# EAGLE design sensor-dev-board (EAGLE 9.1.1)
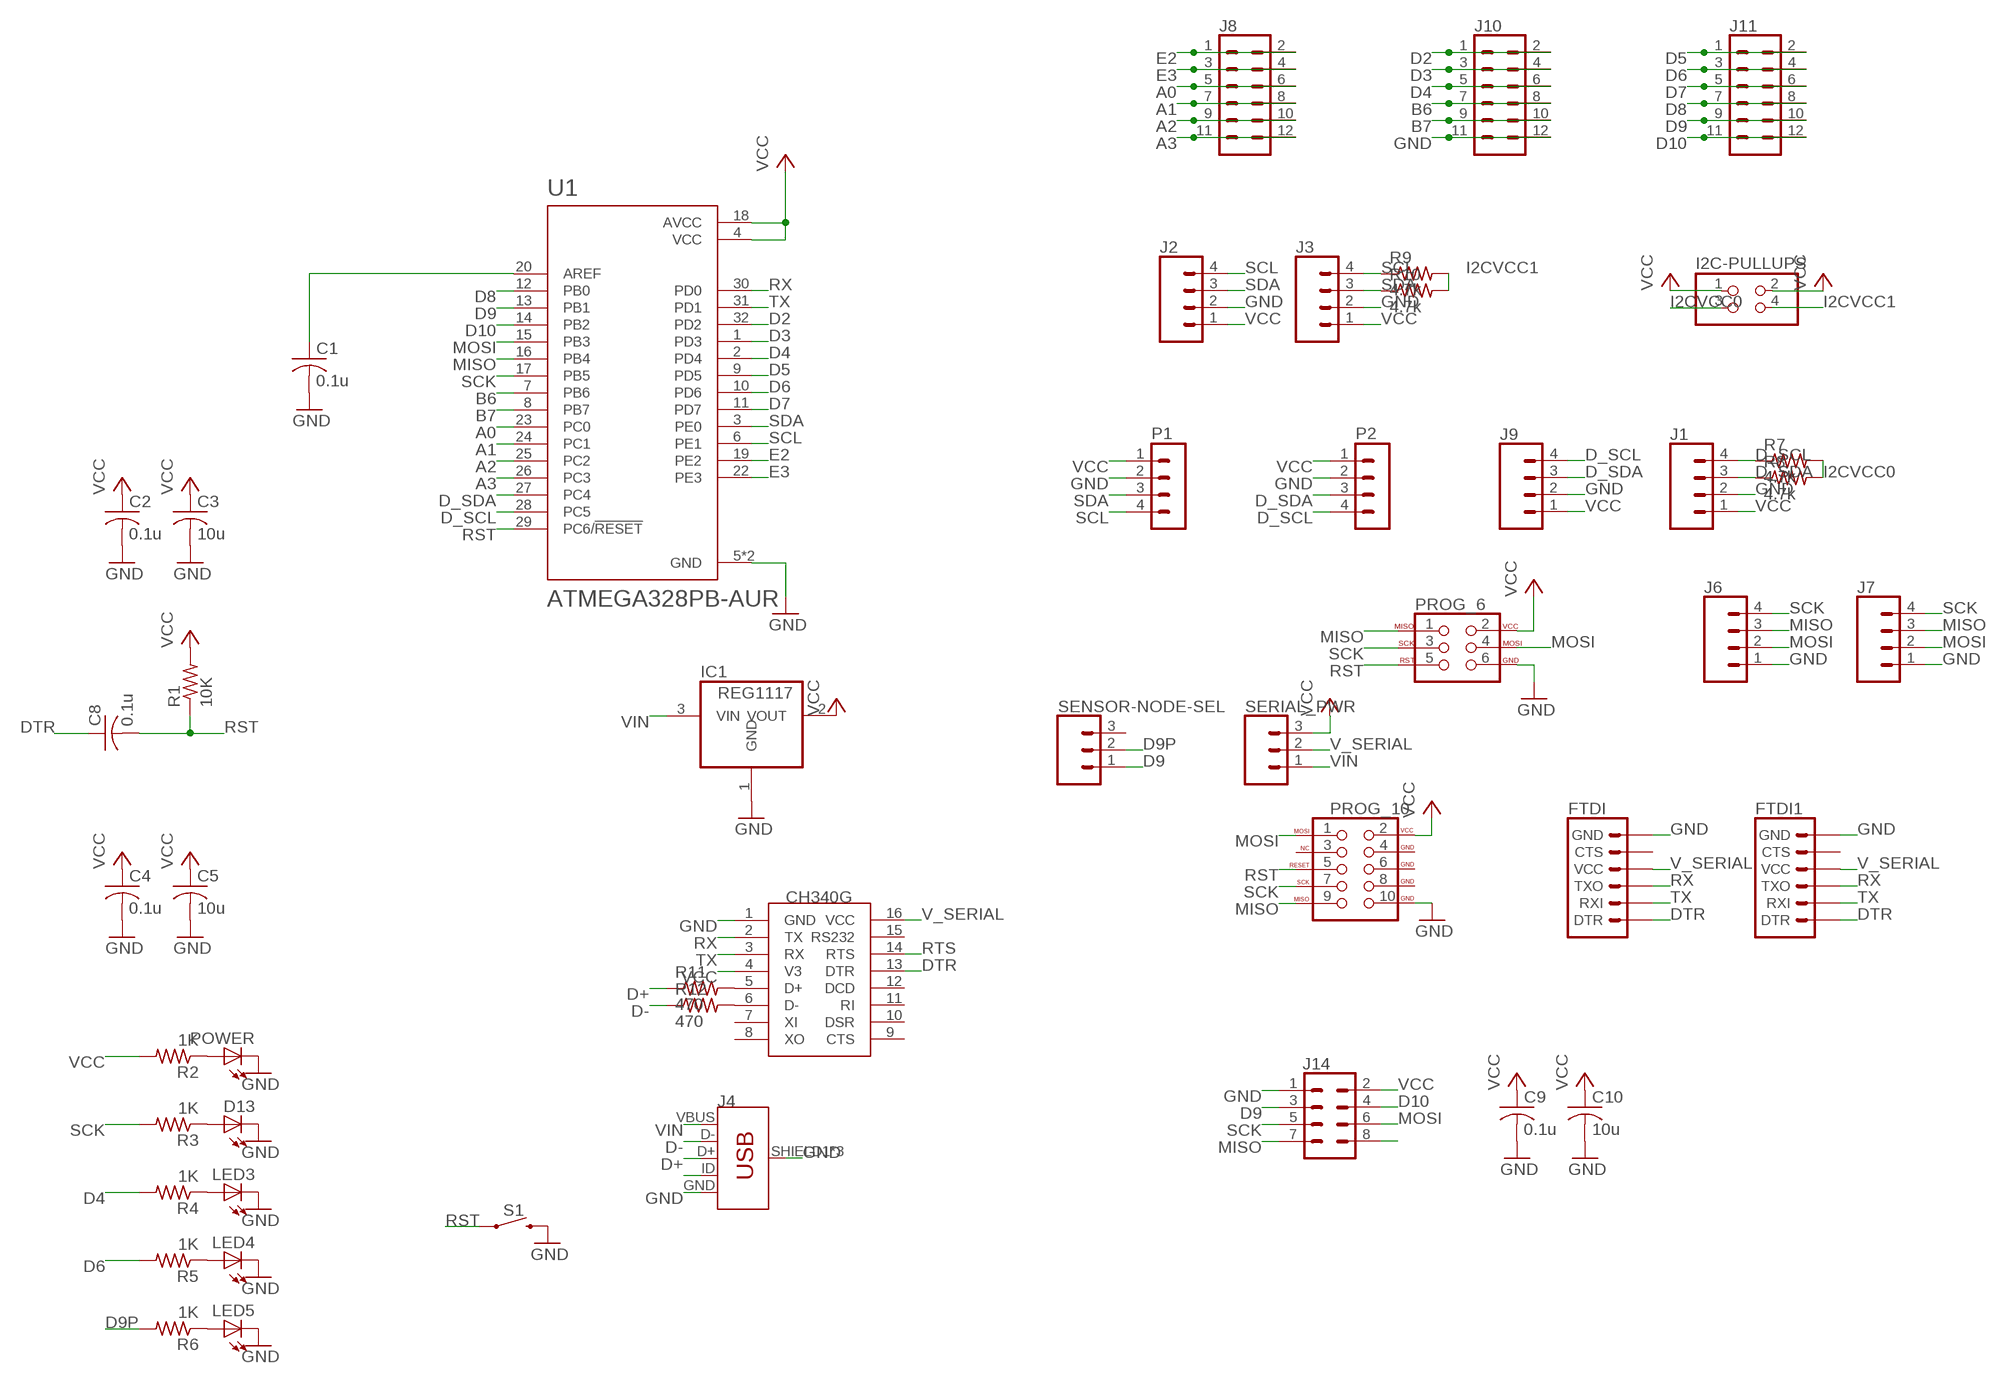
[diagram p0: schematic, sheet 1]

## Parts
C1  0.1u  C-USC1206  [C1206]
C2  0.1u  C-USC1206  [C1206]
C3  10u  C-USC1206  [C1206]
C4  0.1u  C-USC1206  [C1206]
C5  10u  C-USC1206  [C1206]
C8  0.1u  C-USC1206  [C1206]
C9  0.1u  C-USC1206  [C1206]
C10  10u  C-USC1206  [C1206]
CH340C  CH340C  CH340G  [SOIC16]
D13  LEDSML1206  [SML1206]
FTDI  6_PIN_SERIAL_TARGET  [1X06]
FTDI1  6_PIN_SERIAL_TARGET  [1X06]
I2C-PULLUPS  PINHD-2X2  [2X02]
IC1  REG1117  [SOT223]
J1  CONN_04  [1X04]
J2  CONN_04  [1X04]
J3  CONN_04  [1X04]
J4  USB_MICRO-B_FEMALE-SMT  [USB-B-MICRO-SMD]
J6  CONN_04  [1X04]
J7  CONN_04  [1X04]
J8  CONN_06X2PTH_FEMALE  [2X6]
J9  CONN_04  [1X04]
J10  CONN_06X2PTH_FEMALE  [2X6]
J11  CONN_06X2PTH_FEMALE  [2X6]
J14  CONN_04X2  [2X4]
LED3  LEDSML1206  [SML1206]
LED4  LEDSML1206  [SML1206]
LED5  LEDSML1206  [SML1206]
P1  B4B-PH-K  [B4B-PH-K]
P2  B4B-PH-K  [B4B-PH-K]
POWER  LEDSML1206  [SML1206]
PROG_6  AVR_SPI_PROG_3X2PTH  [2X3]
PROG_10  AVR_SPI_PROG_5X2PTH  [2X5]
R1  10K  R-US_R1206  [R1206]
R2  1K  R-US_R1206  [R1206]
R3  1K  R-US_R1206  [R1206]
R4  1K  R-US_R1206  [R1206]
R5  1K  R-US_R1206  [R1206]
R6  1K  R-US_R1206  [R1206]
R7  4.7k  R-US_R1206  [R1206]
R8  4.7k  R-US_R1206  [R1206]
R9  4.7k  R-US_R1206  [R1206]
R10  4.7k  R-US_R1206  [R1206]
R11  470  R-US_R1206  [R1206]
R12  470  R-US_R1206  [R1206]
S1  MOMENTARY-SWITCH-SPST-PTH-6.0MM  [TACTILE_SWITCH_PTH_6.0MM]
SENSOR-NODE-SEL  CONN_03  [1X03]
SERIAL_PWR  CONN_03  [1X03]
U1  ATMEGA328PB-AUR  [QFP80P900X900X120-32N]

## Nets
A0: J8.5 J8.6 U1.23(PC0)
A1: J8.7 J8.8 U1.24(PC1)
A2: J8.9 J8.10 U1.25(PC2)
A3: J8.11 J8.12 U1.26(PC3)
B6: J10.7 J10.8 U1.7(PB6)
B7: J10.9 J10.10 U1.8(PB7)
D2: J10.1 J10.2 U1.32(PD2)
D3: J10.3 J10.4 U1.1(PD3)
D4: J10.5 J10.6 R4.2 U1.2(PD4)
D5: J11.1 J11.2 U1.9(PD5)
D6: J11.3 J11.4 R5.2 U1.10(PD6)
D7: J11.5 J11.6 U1.11(PD7)
D8: J11.7 J11.8 U1.12(PB0)
D9: J11.9 J11.10 J14.3 SENSOR-NODE-SEL.1 U1.13(PB1)
D9P: R6.2 SENSOR-NODE-SEL.2
D10: J11.11 J11.12 J14.4 U1.14(PB2)
D+: J4.D+ R11.1
D-: J4.D- R12.1
D_SCL: J1.4 J9.4 P2.4 R7.1 U1.28(PC5)
D_SDA: J1.3 J9.3 P2.3 R8.1 U1.27(PC4)
DTR: C8.1 CH340C.13(DTR) FTDI1.1(DTR) FTDI.1(DTR)
E2: J8.1 J8.2 U1.19(PE2)
E3: J8.3 J8.4 U1.22(PE3)
GND: C1.2 C2.2 C3.2 C4.2 C5.2 C9.2 C10.2 CH340C.1(GND) D13.C FTDI1.6(GND) FTDI.6(GND) IC1.1(GND) J1.2 J2.2 J3.2 J4.GND J4.SHIELD1(SHIELD) J4.SHIELD2(SHIELD) J4.SHIELD3(SHIELD) J6.1 J7.1 J9.2 J10.11 J10.12 J14.1 LED3.C LED4.C LED5.C P1.2 P2.2 POWER.C PROG_6.6 PROG_10.10(GND) S1.3 U1.5(GND) U1.21(GND)
I2CVCC0: I2C-PULLUPS.3 R7.2 R8.2
I2CVCC1: I2C-PULLUPS.4 R9.2 R10.2
MISO: J6.3 J7.3 J14.7 PROG_6.1 PROG_10.9(MISO) U1.16(PB4)
MOSI: J6.2 J7.2 J14.6 PROG_6.4 PROG_10.1(MOSI) U1.15(PB3)
N$1: CH340C.5(D+) R11.2
N$2: CH340C.6(D-) R12.2
N$5: C1.1 U1.20(AREF)
N$9: J4.ID
N$10: POWER.A R2.1
N$11: D13.A R3.1
N$12: LED3.A R4.1
N$13: LED4.A R5.1
N$14: LED5.A R6.1
N$27: J14.8
RST: C8.2 PROG_6.5 PROG_10.5(RESET) R1.1 S1.1 U1.29(PC6/!RESET)
RTS: CH340C.14(RTS)
RX: CH340C.2(TX) FTDI1.3(TXO) FTDI.3(TXO) U1.30(PD0)
SCK: J6.4 J7.4 J14.5 PROG_6.3 PROG_10.7(SCK) R3.2 U1.17(PB5)
SCL: J2.4 J3.4 P1.4 R9.1 U1.6(PE1)
SDA: J2.3 J3.3 P1.3 R10.1 U1.3(PE0)
TX: CH340C.3(RX) FTDI1.2(RXI) FTDI.2(RXI) U1.31(PD1)
V_SERIAL: CH340C.16(VCC) FTDI1.4(VCC) FTDI.4(VCC) SERIAL_PWR.2
VCC: C2.1 C3.1 C4.1 C5.1 C9.1 C10.1 CH340C.4(V3) I2C-PULLUPS.1 I2C-PULLUPS.2 IC1.2(VOUT) J1.1 J2.1 J3.1 J9.1 J14.2 P1.1 P2.1 PROG_6.2 PROG_10.2(VCC) R1.2 R2.2 SERIAL_PWR.3 U1.4(VCC) U1.18(AVCC)
VIN: IC1.3(VIN) J4.VBUS SERIAL_PWR.1
Unconnected: CH340C.7(XI) CH340C.8(XO) CH340C.9(CTS) CH340C.10(DSR) CH340C.11(RI) CH340C.12(DCD) CH340C.15(RS232) FTDI1.5(CTS) FTDI.5(CTS) PROG_10.3(NC) SENSOR-NODE-SEL.3

## Power pins joined to a net without a drawn wire
GND: PROG_10.4(GND) PROG_10.6(GND) PROG_10.8(GND)

## Library data of the parts
C1-C5 C8-C10 = rcl:C-US: CAPACITOR, American symbol; SPICEPREFIX: C
CH340C = ch340g:CH340G
D13 LED3-LED5 POWER = led:LED: LED OSRAM: - CHIPLED LG R971, LG N971, LY N971, LG Q971, LY Q971, LO R971, LY R971 LH N974, LH R974 LS Q976, LO Q976, LY Q976 LO Q996 - Hyper CHIPLED LW Q18S LB Q993, LB Q99A, LB R99A - SideLED LS A670, LO A670, LY A670, LG A670, LP A670 LB A673, LV A673, LT A673, LW A673 LH A674 LY A675 LS A676, LA A676, LO A676, LY A676, LW A676 LS A679, LY A679, LG A679 - Hyper Micro SIDELED® LS Y876, LA Y876, LO Y876, LY Y876 LT Y87S - SmartLED LW L88C, LW L88S LB L89C, LB L89S, LG L890 LS L89K, LO L89K, LY L89K LS L896, LA L896, LO L896, LY L896 - TOPLED LS T670, LO T670, LY T670, LG T670, LP T670 LSG T670, LSP T670, LSY T670, LOP T670, LYG T670 LG T671, LOG T671, LSG T671 LB T673, LV T673, LT T673, LW T673 LH T674 LS T676, LA T676, LO T676, LY T676, LB T676, LH T676, LSB T676, LW T676 LB T67C, LV T67C, LT T67C, LS T67K, LO T67K, LY T67K, LW E67C LS E67B, LA E67B, LO E67B, LY E67B, LB E67C, LV E67C, LT E67C LW T67C LS T679, LY T679, LG T679 LS T770, LO T770, LY T770, LG T770, LP T770 LB T773, LV T773, LT T773, LW T773 LH T774 LS E675, LA E675, LY E675, LS T675 LS T776, LA T776, LO T776, LY T776, LB T776 LHGB T686 LT T68C, LB T68C - Hyper Mini TOPLED® LB M676 - Mini TOPLED Santana® LG M470 LS M47K, LO M47K, LY M47K Source: http://www.osram.convergy.de LUXEON: - LUMILED® LXK2-PW12-R00, LXK2-PW12-S00, LXK2-PW14-U00, LXK2-PW14-V00 LXK2-PM12-R00, LXK2-PM12-S00, LXK2-PM14-U00 LXK2-PE12-Q00, LXK2-PE12-R00, LXK2-PE12-S00, LXK2-PE14-T00, LXK2-PE14-U00 LXK2-PB12-K00, LXK2-PB12-L00, LXK2-PB12-M00, LXK2-PB14-N00, LXK2-PB14-P00, LXK2-PB14-Q00 LXK2-PR12-L00, LXK2-PR12-M00, LXK2-PR14-Q00, LXK2-PR14-R00 LXK2-PD12-Q00, LXK2-PD12-R00, LXK2-PD12-S00 LXK2-PH12-R00, LXK2-PH12-S00 LXK2-PL12-P00, LXK2-PL12-Q00, LXK2-PL12-R00 Source: www.luxeon.com KINGBRIGHT: KA-3528ASYC Source: www.kingbright.com
FTDI FTDI1 = SparkFun-Connectors:6_PIN_SERIAL_TARGET: 6-pin header connection for use with the "FTDI BASIC" pinout - TARGET SIDE. Also known as "Arduino Serial Program Header". It is used to mate with our FTDI Basic serial programmers using the Arduino IDE. Note, this device has "TARGET" in the name. It is intended to be used on a design that contains a target micro-controller that you wish to program. The "sister" device, named "CABLE" is inteneded to be used on a design that usually lives on the end of your USB cable and prvides the converter chip (FTDI232 or FTDI231x) to commnicate serial RX/TX. You can populate with some of these: Break Away Headers - Straight <https://www.sparkfun.com/products/116> (PRT-00116) For reference (or to suit your programming needs) check out these designs: SparkFun FTDI Basic Breakout - 5V <https://www.sparkfun.com/products/9716> (DEV-09716) SparkFun FTDI Basic Breakout - 3.3V <https://www.sparkfun.com/products/9873> (DEV-09873) SparkFun FTDI SmartBasic <https://www.sparkfun.com/products/12935> (DEV-12935) SparkFun Beefy 3 - FTDI Basic Breakout <https://www.sparkfun.com/products/13746> (DEV-13746)
I2C-PULLUPS = pinhead:PINHD-2X2: PIN HEADER
IC1 = burr-brown:REG1117: 800mA and 1A Low Dropout (LDO) Positive Regulator 1.8V, 2.5V, 2.85V, 3.3V, 5V, and Adj; MPN: REG1117; OC_FARNELL: 1097566; OC_NEWARK: 14P6981
J1-J3 J6 J7 J9 = SparkFun-Connectors:CONN_04: Multi connection point. Often used as Generic Header-pin footprint for 0.1 inch spaced/style header connections On any of the 0.1 inch spaced packages, you can populate with these: Break Away Headers - Straight <https://www.sparkfun.com/products/116> (PRT-00116) Break Away Male Headers - Right Angle <https://www.sparkfun.com/products/553> (PRT-00553) Female Headers <https://www.sparkfun.com/products/115> (PRT-00115) Break Away Headers - Machine Pin <https://www.sparkfun.com/products/117> (PRT-00117) Break Away Female Headers - Swiss Machine Pin <https://www.sparkfun.com/products/743> (PRT-00743) For SCREWTERMINALS and SPRING TERMINALS visit here: Screw Terimnals on SparkFun.com <https://www.sparkfun.com/search/results?term=Screw+Terminals> (5mm/3.5mm/2.54mm spacing) This device is also useful as a general connection point to wire up your design to another part of your project. Our various solder wires solder well into these plated through hole pads. Hook-Up Wire - Assortment (Stranded, 22 AWG) <https://www.sparkfun.com/products/11375> (PRT-11375) Hook-Up Wire - Assortment (Solid Core, 22 AWG) <https://www.sparkfun.com/products/11367> (PRT-11367) View the entire wire category on our website here <https://www.sparkfun.com/categories/141> Special notes: Molex polarized connector foot print use with SKU : PRT-08231 with associated crimp pins and housings. 1MM SMD Version SKU: PRT-10208; PROD_ID: CONN-09696
J4 = SparkFun-Connectors:USB_MICRO-B: USB Type Micro-B Connector Male/female and PTH/SMT variants SparkFun Products: SparkFun microB USB Breakout <https://www.sparkfun.com/products/12035> SparkFun USB microB Plug Breakout <https://www.sparkfun.com/products/10031> SparkFun ESP8266 Thing <https://www.sparkfun.com/products/13231>; PROD_ID: CONN-11752
J8 J10 J11 = SparkFun-Connectors:CONN_06X2: Multi connection point. Often used as Generic Header-pin footprint for 0.1 inch spaced/style header connections On any of the 0.1 inch spaced packages, you can populate with these: Break Away Headers - Straight <https://www.sparkfun.com/products/116> (PRT-00116) Break Away Male Headers - Right Angle <https://www.sparkfun.com/products/553> (PRT-00553) Female Headers <https://www.sparkfun.com/products/115> (PRT-00115) Break Away Headers - Machine Pin <https://www.sparkfun.com/products/117> (PRT-00117) Break Away Female Headers - Swiss Machine Pin <https://www.sparkfun.com/products/743> (PRT-00743); PROD_ID: CONN-12423; VALUE: 2X6 FEMALE
J14 = SparkFun-Connectors:CONN_04X2: Multi connection point. Often used as Generic Header-pin footprint for 0.1 inch spaced/style header connections On any of the 0.1 inch spaced packages, you can populate with these: Break Away Headers - Straight <https://www.sparkfun.com/products/116> (PRT-00116) Break Away Male Headers - Right Angle <https://www.sparkfun.com/products/553> (PRT-00553) Female Headers <https://www.sparkfun.com/products/115> (PRT-00115) Break Away Headers - Machine Pin <https://www.sparkfun.com/products/117> (PRT-00117) Break Away Female Headers - Swiss Machine Pin <https://www.sparkfun.com/products/743> (PRT-00743)
P1 P2 = con-jst-ph:B4B-PH-K: HEADER
PROG_6 = SparkFun-Connectors:AVR_SPI_PROG_3X2: AVR ISP 6 Pin This is the reduced ISP connector for AVR programming. Common on Arduino. This footprint will take up less PCB space and can be used with a 10-pin to 6-pin adapter such as SKU: BOB-08508 **Special note about "TEST_POINT" package. The stop mask is on the top side, so if you want your programming test points to be on the bottom of your board, make sure to place this package on the bottom side of the board. This also ensure that the orientation to program from the bottom side will be correct. SparkFun Products: SparkFun ISP Pogo Adapter <https://www.sparkfun.com/products/11591> - NS Tiny AVR Programmer <https://www.sparkfun.com/products/11801> -PTH
PROG_10 = SparkFun-Connectors:AVR_SPI_PROG_5X2: AVR 10-pin ICSP Header This is the standard AVR In Circuit Serial Programming header. Minimal, but includes pin one indicator. Works with standard Olimex programmers. SparkFun Products: 2x5 AVR ICSP Male Header <https://www.sparkfun.com/products/778> - PTH 2x5 Pin Shrouded Header <https://www.sparkfun.com/products/8506> - PTH2
R1-R12 = resistor:R-US_: RESISTOR, American symbol
S1 = SparkFun-Switches:MOMENTARY-SWITCH-SPST: Momentary Switch (Pushbutton) - SPST Normally-open (NO) SPST momentary switches (buttons, pushbuttons). Variants PTH-12MM - 12mm square, through-hole Momentary Pushbutton Switch - 12mm Square <https://www.sparkfun.com/products/9190> (COM-09190) PTH-6.0MM, PTH-6.0MM-KIT - 6.0mm square, through-hole Mini Pushbutton Switch <https://www.sparkfun.com/products/97> (COM-00097) KIT package intended for soldering kit's - only one side of pads' copper is exposed. PTH-RIGHT-ANGLE-KIT - Right-angle, through-hole Right Angle Tactile Button <https://www.sparkfun.com/products/10791> - Used on SparkFun BigTime Watch Kit <https://www.sparkfun.com/products/11734> SMD-12MM - 12mm square, surface-mount Tactile Button - SMD (12mm) <https://www.sparkfun.com/products/12993> (COM-12993) Used on SparkFun PicoBoard <https://www.sparkfun.com/products/11888> SMD-4.5MM - 4.5mm Square Trackball Switch Used on SparkFun Blackberry Trackballer Breakout <https://www.sparkfun.com/products/13169> SMD-4.6MMX2.8MM - 4.60mm x 2.80mm, surface mount Used on SparkFun SAMD21 Mini Breakout <https://www.sparkfun.com/products/13664> SMD-5.2MM, SMD-5.2-REDUNDANT - 5.2mm square, surface-mount Mini Pushbutton Switch - SMD <https://www.sparkfun.com/products/8720> (COM-08720) Used on Arduino Pro Mini <https://www.sparkfun.com/products/11114> REDUNDANT package connects both switch circuits together SMD-6.0X3.5MM - 6.0 x 3.5mm, surface mount Momentary Reset Switch SMD <https://www.sparkfun.com/products/8229> (COM-08229) SMD-6.2MM-TALL - 6.2mm square, surface mount Tactile Button - SMD (6mm) <https://www.sparkfun.com/products/12992> Used on SparkFun Digital Sandbox <https://www.sparkfun.com/products/12651> SMD-RIGHT-ANGLE - Right-angle, surface mount Used on SparkFun Block for Intel® Edison - Arduino <https://www.sparkfun.com/products/13036>; PROD_ID: SWCH-08441; SF_SKU: COM-00097
SENSOR-NODE-SEL SERIAL_PWR = SparkFun-Connectors:CONN_03: Multi connection point. Often used as Generic Header-pin footprint for 0.1 inch spaced/style header connections On any of the 0.1 inch spaced packages, you can populate with these: Break Away Headers - Straight <https://www.sparkfun.com/products/116> (PRT-00116) Break Away Male Headers - Right Angle <https://www.sparkfun.com/products/553> (PRT-00553) Female Headers <https://www.sparkfun.com/products/115> (PRT-00115) Break Away Headers - Machine Pin <https://www.sparkfun.com/products/117> (PRT-00117) Break Away Female Headers - Swiss Machine Pin <https://www.sparkfun.com/products/743> (PRT-00743) Stackable Header - 3 Pin (Female, 0.1") <https://www.sparkfun.com/products/13875> (PRT-13875) For SCREWTERMINALS and SPRING TERMINALS visit here: Screw Terimnals on SparkFun.com <https://www.sparkfun.com/search/results?term=Screw+Terminals> (5mm/3.5mm/2.54mm spacing) This device is also useful as a general connection point to wire up your design to another part of your project. Our various solder wires solder well into these plated through hole pads. Hook-Up Wire - Assortment (Stranded, 22 AWG) <https://www.sparkfun.com/products/11375> (PRT-11375) Hook-Up Wire - Assortment (Solid Core, 22 AWG) <https://www.sparkfun.com/products/11367> (PRT-11367) View the entire wire category on our website here <https://www.sparkfun.com/categories/141> Special notes: Molex polarized connector foot print use with SKU : PRT-08232 with associated crimp pins and housings.; PROD_ID: XXX-00000; VALUE: 455-1750-1-ND
U1 = ATMEGA328PB-AUR:ATMEGA328PB-AUR: ATmega Series 20 MHz 32 KB Flash 2 KB SRAM 8-Bit Microcontroller - TQFP-32; DESCRIPTION: AVR microcontroller; EEPROM: 1024B; SRAM: 2kB; Flash: 32kB; TQFP32; DIGI-KEY_PART_NUMBER: ATMEGA328PB-AURCT-ND; DIGI-KEY_PURCHASE_URL: https://www.digikey.com/product-detail/en/microchip-technology/ATMEGA328PB-AUR/ATMEGA328PB-AURCT-ND/5722706?WT.z_cid=ref_snapeda&utm_source=snapeda&utm_medium=aggregator&utm_campaign=buynow; MF: Microchip; MP: ATMEGA328PB-AUR; PACKAGE: TQFP-32 Microchip

## Board
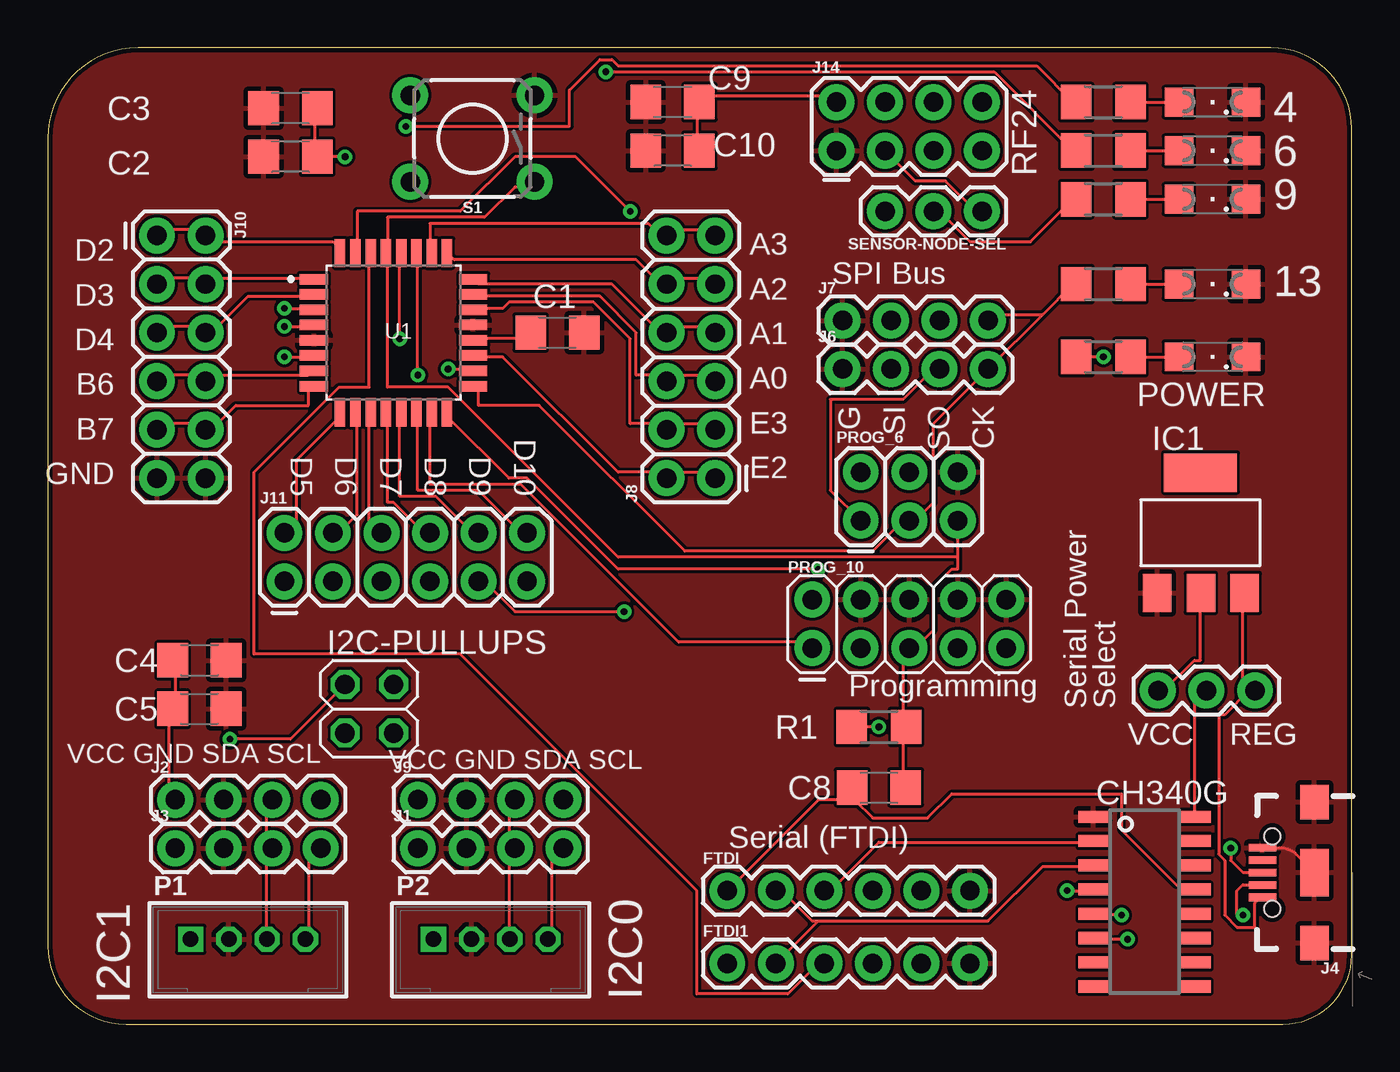
[diagram p1: board, top side]
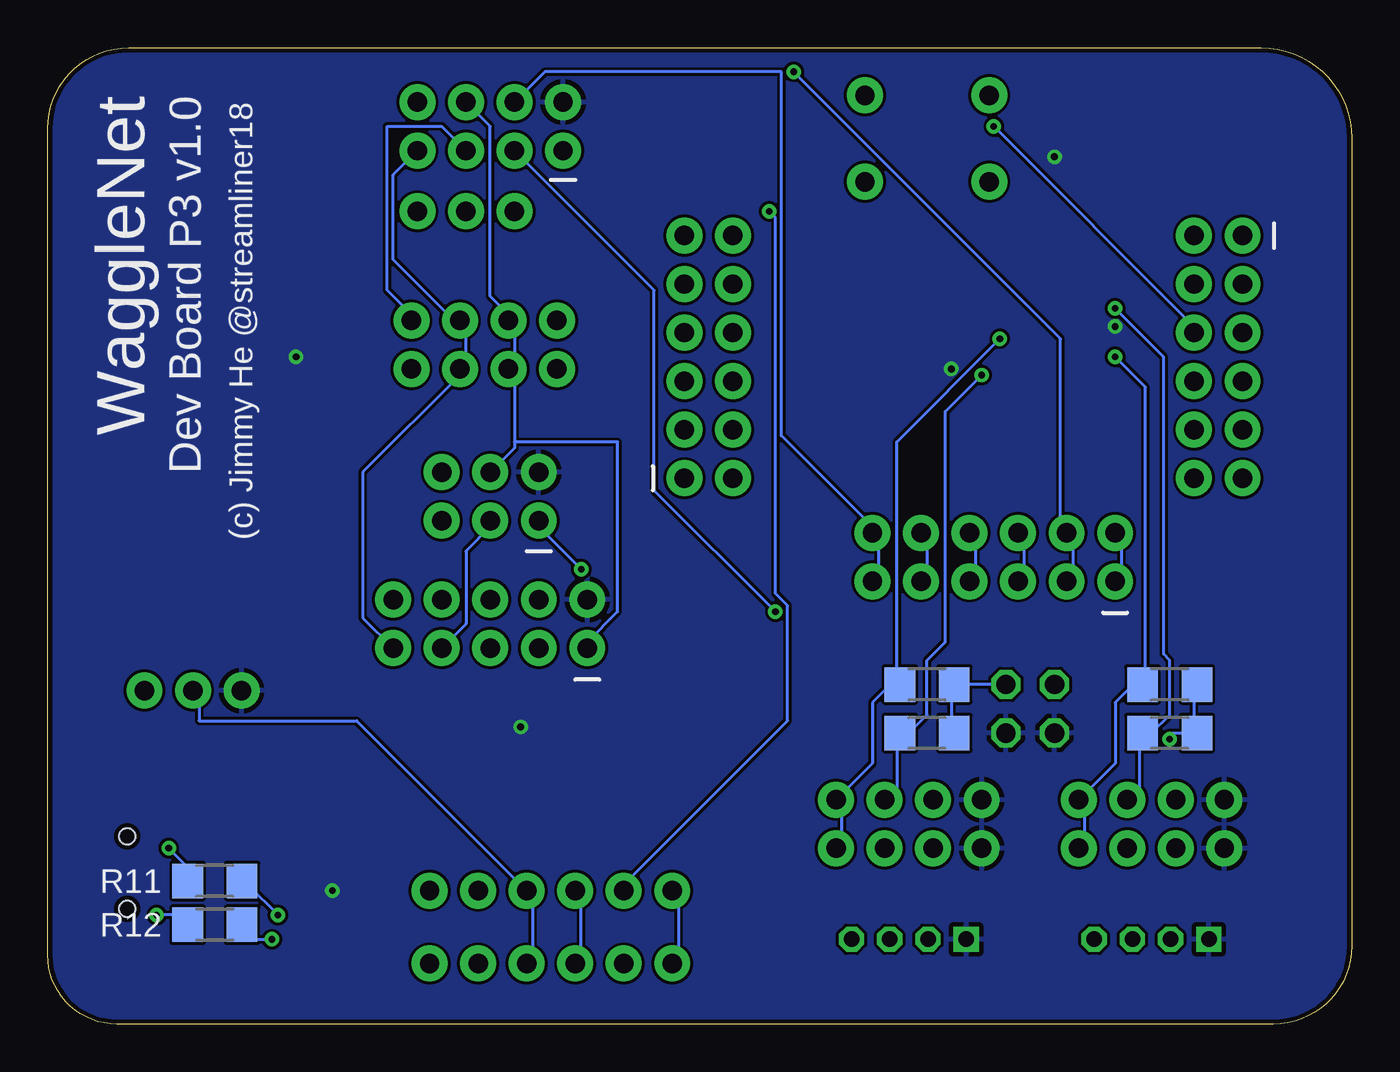
[diagram p2: board, bottom side, seen from below]

Size 68.24 x 51.1 mm. Coordinates in mm from the lower left corner, seen from the top.
Outline: 0,46.37 0,4.1 arc90 4.09,0 64.63,0 arc90 68.24,3.61 68.24,46.88 arc90 64.02,51.1 4.74,51.1 arc90 0,46.37
Copper layers (1*16): Top 0.035mm / dielectric 1.5mm / Bottom 0.035mm
Design rules "default *": minimum track width 6mil, minimum drill 0.35mm, track to track 6mil, track to pad 6mil, pad to pad 6mil, via to via 6mil, smd to smd 6mil, copper to edge 10mil, drill to drill 6mil, minimum pad ring 10mil, minimum via ring 8mil, stop-mask expansion 4mil, vias tented up to drill 20mil, thermal gap 10mil

### Footprints (pad centres in the part's own frame; a part is rotated, then mirrored left to right if it is on the bottom)
C1206 = smd 1.6 x 1.8: 1 -1.4,0; 2 1.4,0
SOIC16 = smd 0.635 x 1.524: 1 -4.445,-2.695; 2 -3.175,-2.695; 3 -1.905,-2.695; 4 -0.635,-2.695; 5 0.635,-2.695; 6 1.905,-2.695; 7 3.175,-2.695; 8 4.445,-2.695; 9 4.445,2.695; 10 3.175,2.695; 11 1.905,2.695; 12 0.635,2.695; 13 -0.635,2.695; 14 -1.905,2.695; 15 -3.175,2.695; 16 -4.445,2.695
SML1206 = smd 1.5 x 1.5: A 1.75,0; C -1.75,0
1X06 = drill 1.016 pad 1.88: 1 0,0; 2 2.54,0; 3 5.08,0; 4 7.62,0; 5 10.16,0; 6 12.7,0
2X02 = drill 1.016 octagon: 1 -1.27,-1.27; 2 -1.27,1.27; 3 1.27,-1.27; 4 1.27,1.27
SOT223 = smd 1.499 x 2.007: 1 -2.261,-3.15; 2 0.025,-3.15; 3 2.311,-3.15 | smd 3.81 x 2.007: 4 0,3.15
1X04 = drill 1.016 pad 1.88: 1 0,0; 2 2.54,0; 3 5.08,0; 4 7.62,0
USB-B-MICRO-SMD = smd 1.45 x 0.4: D+ 2.725,0; D- 2.725,0.65; GND 2.725,-1.3; ID 2.725,-0.65; VBUS 2.725,1.3 | smd 1.5 x 1.8: SHIELD1 0,3.685; SHIELD2 0,-3.685 | smd 1.5 x 2.5: SHIELD3 0,0 | hole 0.85: 2.2,1.9; 2.2,-1.9
2X6 = drill 1.016 pad 1.88: 1 0,0; 2 0,2.54; 3 2.54,0; 4 2.54,2.54; 5 5.08,0; 6 5.08,2.54; 7 7.62,0; 8 7.62,2.54; 9 10.16,0; 10 10.16,2.54; 11 12.7,0; 12 12.7,2.54
2X4 = drill 1.016 pad 1.88: 1 -3.81,-1.27; 2 -3.81,1.27; 3 -1.27,-1.27; 4 -1.27,1.27; 5 1.27,-1.27; 6 1.27,1.27; 7 3.81,-1.27; 8 3.81,1.27
B4B-PH-K = drill 0.813 square: 1 -3,0 | drill 0.813 octagon: 2 -1,0; 3 1,0; 4 3,0
2X3 = drill 1.016 pad 1.88: 1 0,0; 2 0,2.54; 3 2.54,0; 4 2.54,2.54; 5 5.08,0; 6 5.08,2.54
2X5 = drill 1.016 pad 1.88: 1 0,0; 2 0,2.54; 3 2.54,0; 4 2.54,2.54; 5 5.08,0; 6 5.08,2.54; 7 7.62,0; 8 7.62,2.54; 9 10.16,0; 10 10.16,2.54
R1206 = smd 1.6 x 1.803: 1 -1.422,0; 2 1.422,0
TACTILE_SWITCH_PTH_6.0MM = drill 1.016 pad 1.88: 1 -3.251,2.261; 2 3.251,2.261; 3 -3.251,-2.261; 4 3.251,-2.261
1X03 = drill 1.016 pad 1.88: 1 0,0; 2 2.54,0; 3 5.08,0
QFP80P900X900X120-32N = smd 1.47 x 0.55: 1 -4.17,2.8; 2 -4.17,2; 3 -4.17,1.2; 4 -4.17,0.4; 5 -4.17,-0.4; 6 -4.17,-1.2; 7 -4.17,-2; 8 -4.17,-2.8; 17 4.17,-2.8; 18 4.17,-2; 19 4.17,-1.2; 20 4.17,-0.4; 21 4.17,0.4; 22 4.17,1.2; 23 4.17,2; 24 4.17,2.8 | smd 0.55 x 1.47: 9 -2.8,-4.17; 10 -2,-4.17; 11 -1.2,-4.17; 12 -0.4,-4.17; 13 0.4,-4.17; 14 1.2,-4.17; 15 2,-4.17; 16 2.8,-4.17; 25 2.8,4.17; 26 2,4.17; 27 1.2,4.17; 28 0.4,4.17; 29 -0.4,4.17; 30 -1.2,4.17; 31 -2,4.17; 32 -2.8,4.17

### Placement (x,y rotation side)
C1  26.67,36.2 0 top
C2  12.7,45.4 180 top
C3  12.7,47.94 180 top
C4  7.94,19.05 0 top
C5  7.94,16.51 0 top
C8  43.5,12.38 0 top
C9  32.7,48.26 180 top
C10  32.7,45.72 180 top
CH340C  57.4,6.41 270 top
D13  60.96,38.73 180 top
FTDI  35.56,6.98 0 top
FTDI1  35.56,3.18 0 top
I2C-PULLUPS  16.83,16.51 90 top
IC1  60.32,25.72 0 top
J1  19.37,9.21 0 top
J2  6.67,11.75 0 top
J3  6.67,9.21 0 top
J4  66.29,7.94 180 top
J6  41.59,34.29 0 top
J7  41.59,36.83 0 top
J8  34.92,28.58 90 top
J9  19.37,11.75 0 top
J10  5.71,41.27 270 top
J11  12.38,23.18 0 top
J14  45.09,46.99 0 top
LED3  60.96,48.26 180 top
LED4  60.96,45.72 180 top
LED5  60.96,43.18 180 top
P1  10.48,4.45 0 top
P2  23.18,4.45 0 top
POWER  60.96,34.93 180 top
PROG_6  42.54,26.35 0 top
PROG_10  40,19.69 0 top
R1  43.5,15.56 180 top
R2  55.24,34.93 180 top
R3  55.24,38.73 180 top
R4  55.24,48.26 180 top
R5  55.24,45.72 180 top
R6  55.24,43.18 180 top
R7  22.23,17.78 0 bottom
R8  22.23,15.24 0 bottom
R9  9.53,17.78 0 bottom
R10  9.53,15.24 0 bottom
R11  59.5,7.49 0 bottom
R12  59.5,5.21 0 bottom
S1  22.23,46.35 180 top
SENSOR-NODE-SEL  48.89,42.55 180 top
SERIAL_PWR  63.18,17.46 180 top
U1  18.1,36.2 0 top

### Tracks (layer width: path | path; a pad name or v marks a point on that pad's centre or on a via)
A0
  Top 0.152: 32.07,33.97 30.8,33.97 30.8,36.2 28.89,38.1 22.54,38.1 U1.23 | 32.07,33.97 J8.6 32.07,33.97 | J8.5 34.61,33.97 32.07,33.97
A1
  Top 0.152: 31.75,36.51 32.07,36.2 J8.8 31.75,36.51 | 31.75,36.51 29.53,38.73 22.54,38.73 U1.24 | J8.7 34.61,36.51 31.75,36.51
A2
  Top 0.152: 31.75,39.05 32.07,38.73 J8.10 31.75,39.05 | 31.75,39.05 30.8,40.01 21.27,40.01 20.95,40.32 U1.25 | J8.9 34.61,39.05 31.75,39.05
A3
  Top 0.152: 31.75,41.59 32.07,41.27 J8.12 31.75,41.59 | 31.75,41.59 31.43,41.91 20,41.91 20,40.64 U1.26 | J8.11 34.61,41.59 31.75,41.59
B6
  Top 0.152: 8.57,33.97 13.65,33.97 U1.7 | 8.57,33.97 J10.8 8.57,33.97 | J10.7 6.03,33.97 8.57,33.97
B7
  Top 0.152: 8.89,31.43 8.57,31.12 J10.10 8.89,31.43 | 8.89,31.43 9.84,32.38 13.65,32.38 13.65,33.34 U1.8 | J10.9 6.03,31.43 8.89,31.43
D2
  Top 0.152: U1.32 15.24,40.64 14.92,40.96 8.57,40.96 J10.2 7.94,41.59 6.03,41.59 J10.1
D3
  Top 0.152: 8.57,39.05 13.65,39.05 U1.1 | 8.57,39.05 J10.4 8.57,39.05 | J10.3 6.03,39.05 8.57,39.05
D4  (via drill 0.35)
  Top 0.152: 8.89,36.51 8.57,36.2 J10.6 8.89,36.51 | 8.89,36.51 10.48,38.1 13.65,38.1 U1.2 | v18.73,46.99 27.3,46.99 27.3,48.9 28.89,50.48 29.53,50.48 29.84,50.16 51.75,50.16 53.66,48.26 R4.2 | J10.5 6.03,36.51 8.89,36.51
  Bottom 0.152: v18.73,46.99 8.26,36.51 J10.6
D5
  Top 0.152: J11.2 13.02,25.72 13.02,29.53 15.24,31.75 U1.9
  Bottom 0.152: J11.1 12.06,23.49 12.06,25.4 J11.2
D6  (via drill 0.35)
  Top 0.152: J11.4 15.24,25.72 16.19,26.67 16.19,31.75 U1.10 | v29.21,49.85 49.53,49.85 53.66,45.72 R5.2
  Bottom 0.152: v29.21,49.85 15.24,35.88 15.24,26.04 J11.4 14.6,25.4 14.6,23.49 J11.3
D7
  Top 0.152: J11.6 16.83,25.72 16.83,31.75 U1.11
  Bottom 0.152: J11.5 17.14,23.49 17.14,25.4 J11.6
D8
  Top 0.152: J11.8 19.69,25.72 18.1,27.3 17.78,27.3 17.78,31.75 U1.12
  Bottom 0.152: J11.7 19.69,23.49 19.69,25.4 J11.8
D9  (via drill 0.35)
  Top 0.152: J14.3 45.4,44.13 46.99,44.13 48.58,42.55 SENSOR-NODE-SEL.1 | J11.10 22.23,25.72 20.32,27.62 18.41,27.62 18.41,31.75 U1.13 | v30.16,21.59 24.45,21.59 22.86,23.18 J11.9
  Bottom 0.152: J11.9 22.23,23.49 22.23,25.4 J11.10 | J14.3 36.51,38.42 36.51,27.94 v30.16,21.59
D9P
  Top 0.152: SENSOR-NODE-SEL.2 46.67,42.55 48.26,40.96 51.43,40.96 53.66,43.18 R6.2
D10
  Top 0.152: J11.12 24.77,25.72 22.54,27.94 19.37,27.94 19.37,31.75 U1.14
  Bottom 0.152: J11.11 24.77,23.49 24.77,25.4 J11.12 25.08,26.04 29.84,30.8 29.84,49.85 42.23,49.85 J14.4
D+  (via drill 0.35)
  Top 0.152: v61.91,9.21 61.91,8.57 62.55,7.94 63.5,7.94 J4.D+
  Bottom 0.152: v61.91,9.21 60.96,8.26 60.96,7.62 R11.1
D-  (via drill 0.35)
  Top 0.152: v62.55,5.71 62.23,5.71 62.23,6.98 62.55,7.3 63.5,7.3 J4.D-
  Bottom 0.152: v62.55,5.71 60.96,5.71 60.96,5.4 R12.1
D_SCL  (via drill 0.35)
  Top 0.152: J1.4 26.35,9.21 26.35,4.45 P2.4 | v18.41,35.88 18.41,40.32 U1.28
  Bottom 0.152: J1.4 26.67,9.53 26.67,11.43 J9.4 25.08,13.65 25.08,16.83 23.81,18.1 | v18.41,35.88 23.81,30.48 23.81,18.1 | 23.81,18.1 23.81,17.78 R7.1 23.81,18.1
D_SDA  (via drill 0.35)
  Top 0.152: 24.13,9.21 24.13,4.45 P2.3 | 24.13,9.21 J1.3 24.13,9.21 | v19.37,33.97 19.37,40.32 U1.27 | 24.13,9.21 24.13,11.75 J9.3
  Bottom 0.152: v19.37,33.97 21.27,32.07 21.27,20 22.23,19.05 22.23,16.19 23.18,15.24 23.49,15.24 R8.1 23.81,15.24 23.81,12.38 J9.3
DTR
  Top 0.152: 42.23,11.75 43.18,10.8 46.04,10.8 47.31,12.07 56.2,12.07 56.2,10.16 59.05,7.3 60.01,7.3 CH340C.13 | 42.23,11.75 42.23,12.38 C8.1 42.23,11.75 | FTDI.1 40.32,11.75 42.23,11.75
  Bottom 0.152: FTDI1.1 35.24,3.49 35.24,6.67 FTDI.1
E2
  Top 0.152: 32.07,28.89 29.84,28.89 23.81,34.93 22.54,34.93 U1.19 | 32.07,28.89 J8.2 32.07,28.89 | J8.1 34.61,28.89 32.07,28.89
E3
  Top 0.152: 32.07,31.43 30.48,31.43 30.48,35.88 28.57,37.78 24.13,37.78 23.81,37.47 22.54,37.47 U1.22 | 32.07,31.43 J8.4 32.07,31.43 | J8.3 34.61,31.43 32.07,31.43
GND
  Top 0.152: J4.GND 64.47,9.24 arc-45 65.37,8.87 J4.SHIELD3
  pour Top: -23.5,60.32 -23.5,-24.77 78.11,-24.77 78.11,60.32
I2CVCC0
  Bottom 0.152: R8.2 20.95,15.24 20.95,17.78 R7.2 20.64,17.78 I2C-PULLUPS.3
I2CVCC1  (via drill 0.35)
  Top 0.152: v9.53,14.92 12.7,14.92 I2C-PULLUPS.4
  Bottom 0.152: 8.26,15.24 8.26,17.78 R9.2 | 8.26,15.24 R10.2 8.26,15.24 | 8.26,15.24 9.53,15.24 v9.53,14.92
MISO  (via drill 0.35)
  Top 0.152: v40.32,23.81 29.84,23.81 25.08,28.58 24.13,28.58 20.95,31.75 U1.16 | PROG_6.1 40.96,27.94 40.96,32.7 44.77,32.7 46.35,34.29 J6.3
  Bottom 0.152: v40.32,23.81 42.54,26.04 PROG_6.1 | PROG_10.9 51.75,21.27 51.75,28.89 46.67,33.97 J6.3 46.35,34.61 46.35,36.2 | 46.35,36.2 46.35,36.51 J7.3 46.35,36.2 | J14.7 50.16,44.45 50.16,40.01 46.35,36.2
MOSI
  Top 0.152: PROG_10.1 39.69,20 33.02,20 24.77,28.26 20,28.26 20,31.75 U1.15
  Bottom 0.152: 43.81,34.61 J6.2 43.81,34.61 | 43.81,34.61 43.81,36.51 J7.2 44.13,37.15 45.09,38.1 45.09,46.99 J14.6 | PROG_6.4 43.81,30.16 43.81,30.48 | 43.81,34.61 43.81,30.48 | 43.81,30.48 38.42,30.48 38.42,21.59 40,20 PROG_10.1
N$1  (via drill 0.35)
  Top 0.152: v56.2,5.71 54.93,5.71 CH340C.5
  Bottom 0.152: v56.2,5.71 57.79,7.3 R11.2
N$2  (via drill 0.35)
  Top 0.152: v56.51,4.45 54.93,4.45 CH340C.6
  Bottom 0.152: v56.51,4.45 57.79,4.45 57.79,5.08 R12.2
N$5
  Top 0.152: U1.20 22.54,35.88 24.77,35.88 25.08,36.2 C1.1
N$10
  Top 0.152: POWER.A 59.05,34.93 56.83,34.93 R2.1
N$11
  Top 0.152: D13.A 59.05,38.73 56.83,38.73 R3.1
N$12
  Top 0.152: LED3.A 59.05,48.26 56.83,48.26 R4.1
N$13
  Top 0.152: LED4.A 59.05,45.72 56.83,45.72 R5.1
N$14
  Top 0.152: LED5.A 59.05,43.18 56.83,43.18 R6.1
RST
  Top 0.152: S1.1 25.4,43.81 24.45,43.81 22.86,42.23 17.78,42.23 17.78,40.64 U1.29 17.78,40.32 17.78,33.34 20.95,33.34 29.84,24.45 47.62,24.45 | 44.77,15.56 44.77,12.38 C8.2 | 44.77,15.56 R1.1 44.77,15.56 | 44.77,15.56 44.77,19.69 PROG_10.5 45.4,19.69 46.35,20.64 46.35,22.86 47.31,23.81 47.62,23.81 47.62,24.45 | 47.62,24.45 PROG_6.5
RX
  Top 0.152: FTDI.3 40.96,6.98 43.5,9.53 54.61,9.53 CH340C.2 | FTDI1.3 40.32,3.18 38.73,1.59 33.97,1.59 33.97,6.98 21.59,19.37 10.79,19.37 10.79,28.89 15.24,33.34 16.83,33.34 16.83,40.32 U1.30
  Bottom 0.152: FTDI.3 40.32,6.67 40.32,3.49 FTDI1.3
SCK
  Top 0.152: 52.07,37.15 53.66,38.73 R3.2 | 52.07,37.15 49.53,37.15 J7.4 | 52.07,37.15 J6.4 46.35,31.43 46.35,27.3 45.4,26.35 PROG_6.3 44.77,26.35 43.18,24.77 33.34,24.77 25.72,32.38 22.54,32.38 22.54,33.34 U1.17
  Bottom 0.152: J14.5 47.62,46.99 50.48,46.99 50.48,38.42 49.21,37.15 J7.4 | PROG_10.7 46.35,20.95 46.35,24.77 45.09,26.04 PROG_6.3
SCL  (via drill 0.35)
  Top 0.152: J3.4 13.65,9.21 13.65,4.45 P1.4 | v12.38,34.93 13.65,34.93 U1.6
  Bottom 0.152: J3.4 13.97,9.53 13.97,11.43 J2.4 12.38,13.65 12.38,16.83 10.79,18.41 | v12.38,34.93 10.79,33.34 10.79,18.41 | 10.79,18.41 10.79,17.78 R9.1 10.79,18.41
SDA  (via drill 0.35)
  Top 0.152: 11.43,9.21 11.43,4.45 P1.3 | 11.43,9.21 J3.3 11.43,9.21 | v12.38,37.47 13.65,37.47 U1.3 | 11.43,9.21 11.43,11.75 J2.3
  Bottom 0.152: v12.38,37.47 9.84,34.93 9.84,19.37 9.53,19.05 9.53,16.19 10.48,15.24 10.79,15.24 R10.1 11.11,15.24 11.11,12.38 J2.3
TX  (via drill 0.35)
  Top 0.152: v30.48,42.55 27.62,45.4 24.45,45.4 21.59,42.55 16.19,42.55 16.19,40.64 U1.31 | 40.32,5.4 40,5.4 38.42,6.98 FTDI.2 | 40.32,5.4 49.21,5.4 52.07,8.26 54.61,8.26 CH340C.3 | 40.32,5.4 FTDI1.2
  Bottom 0.152: v30.48,42.55 30.16,42.23 30.16,22.54 29.53,21.91 29.53,15.88 38.1,7.3 FTDI.2
V_SERIAL
  Top 0.152: SERIAL_PWR.2 60.01,17.46 60.01,11.11 CH340C.16
  Bottom 0.152: FTDI1.4 42.86,3.49 42.86,6.67 FTDI.4 52.07,15.88 60.32,15.88 60.32,17.15 SERIAL_PWR.2
VCC  (via drill 0.35)
  Top 0.152: C10.1 33.97,45.72 33.97,48.26 C9.1 34.29,48.26 34.61,48.58 40.96,48.58 J14.2 | C3.1 13.97,47.94 13.97,45.4 C2.1 14.29,45.4 v15.56,45.4 | C4.1 6.67,19.05 6.67,16.51 C5.1 6.35,16.51 6.35,11.75 J2.1 | v12.38,36.51 13.65,36.51 U1.4 | v20.95,34.29 22.23,34.29 U1.18 | v53.34,6.98 54.61,6.98 CH340C.4 | v43.5,15.56 42.23,15.56 R1.2 | v55.24,34.93 53.97,34.93 R2.2 | SERIAL_PWR.3 58.42,17.46 60.01,19.05 60.32,19.05 60.32,22.54 IC1.2
  pour Bottom: -23.5,62.87 -23.5,-28.57 83.19,-28.57 83.19,62.87
VIN
  Top 0.152: 62.87,17.46 61.59,16.19 61.28,16.19 61.28,8.89 61.59,8.57 61.59,5.71 62.23,5.08 63.18,5.08 63.18,6.35 63.5,6.67 J4.VBUS | 62.87,17.46 SERIAL_PWR.1 62.87,17.46 | 62.87,17.46 62.55,17.46 62.55,22.54 IC1.3

### Text on the board
tPlace: RF24 | SPI Bus | G / SI / SO / CK | D2 / D3 / D4 / B6 / B7 / GND | A3 / A2 / A1 / A0 / E3 / E2 | D10 / D9 / D8 / D7 / D6 / D5 | Programming | Serial Power / Select | VCC REG | VCC GND SDA SCL | VCC GND SDA SCL | Serial (FTDI) | I2C1 | I2C0
tNames: 4 / 6 / 9 / / 13
bNames: (c) Jimmy He @streamliner18 | Dev Board P3 v1.0 | WaggleNet